# EAGLE schematic BMS_Rev1 (EAGLE 7.0.0)
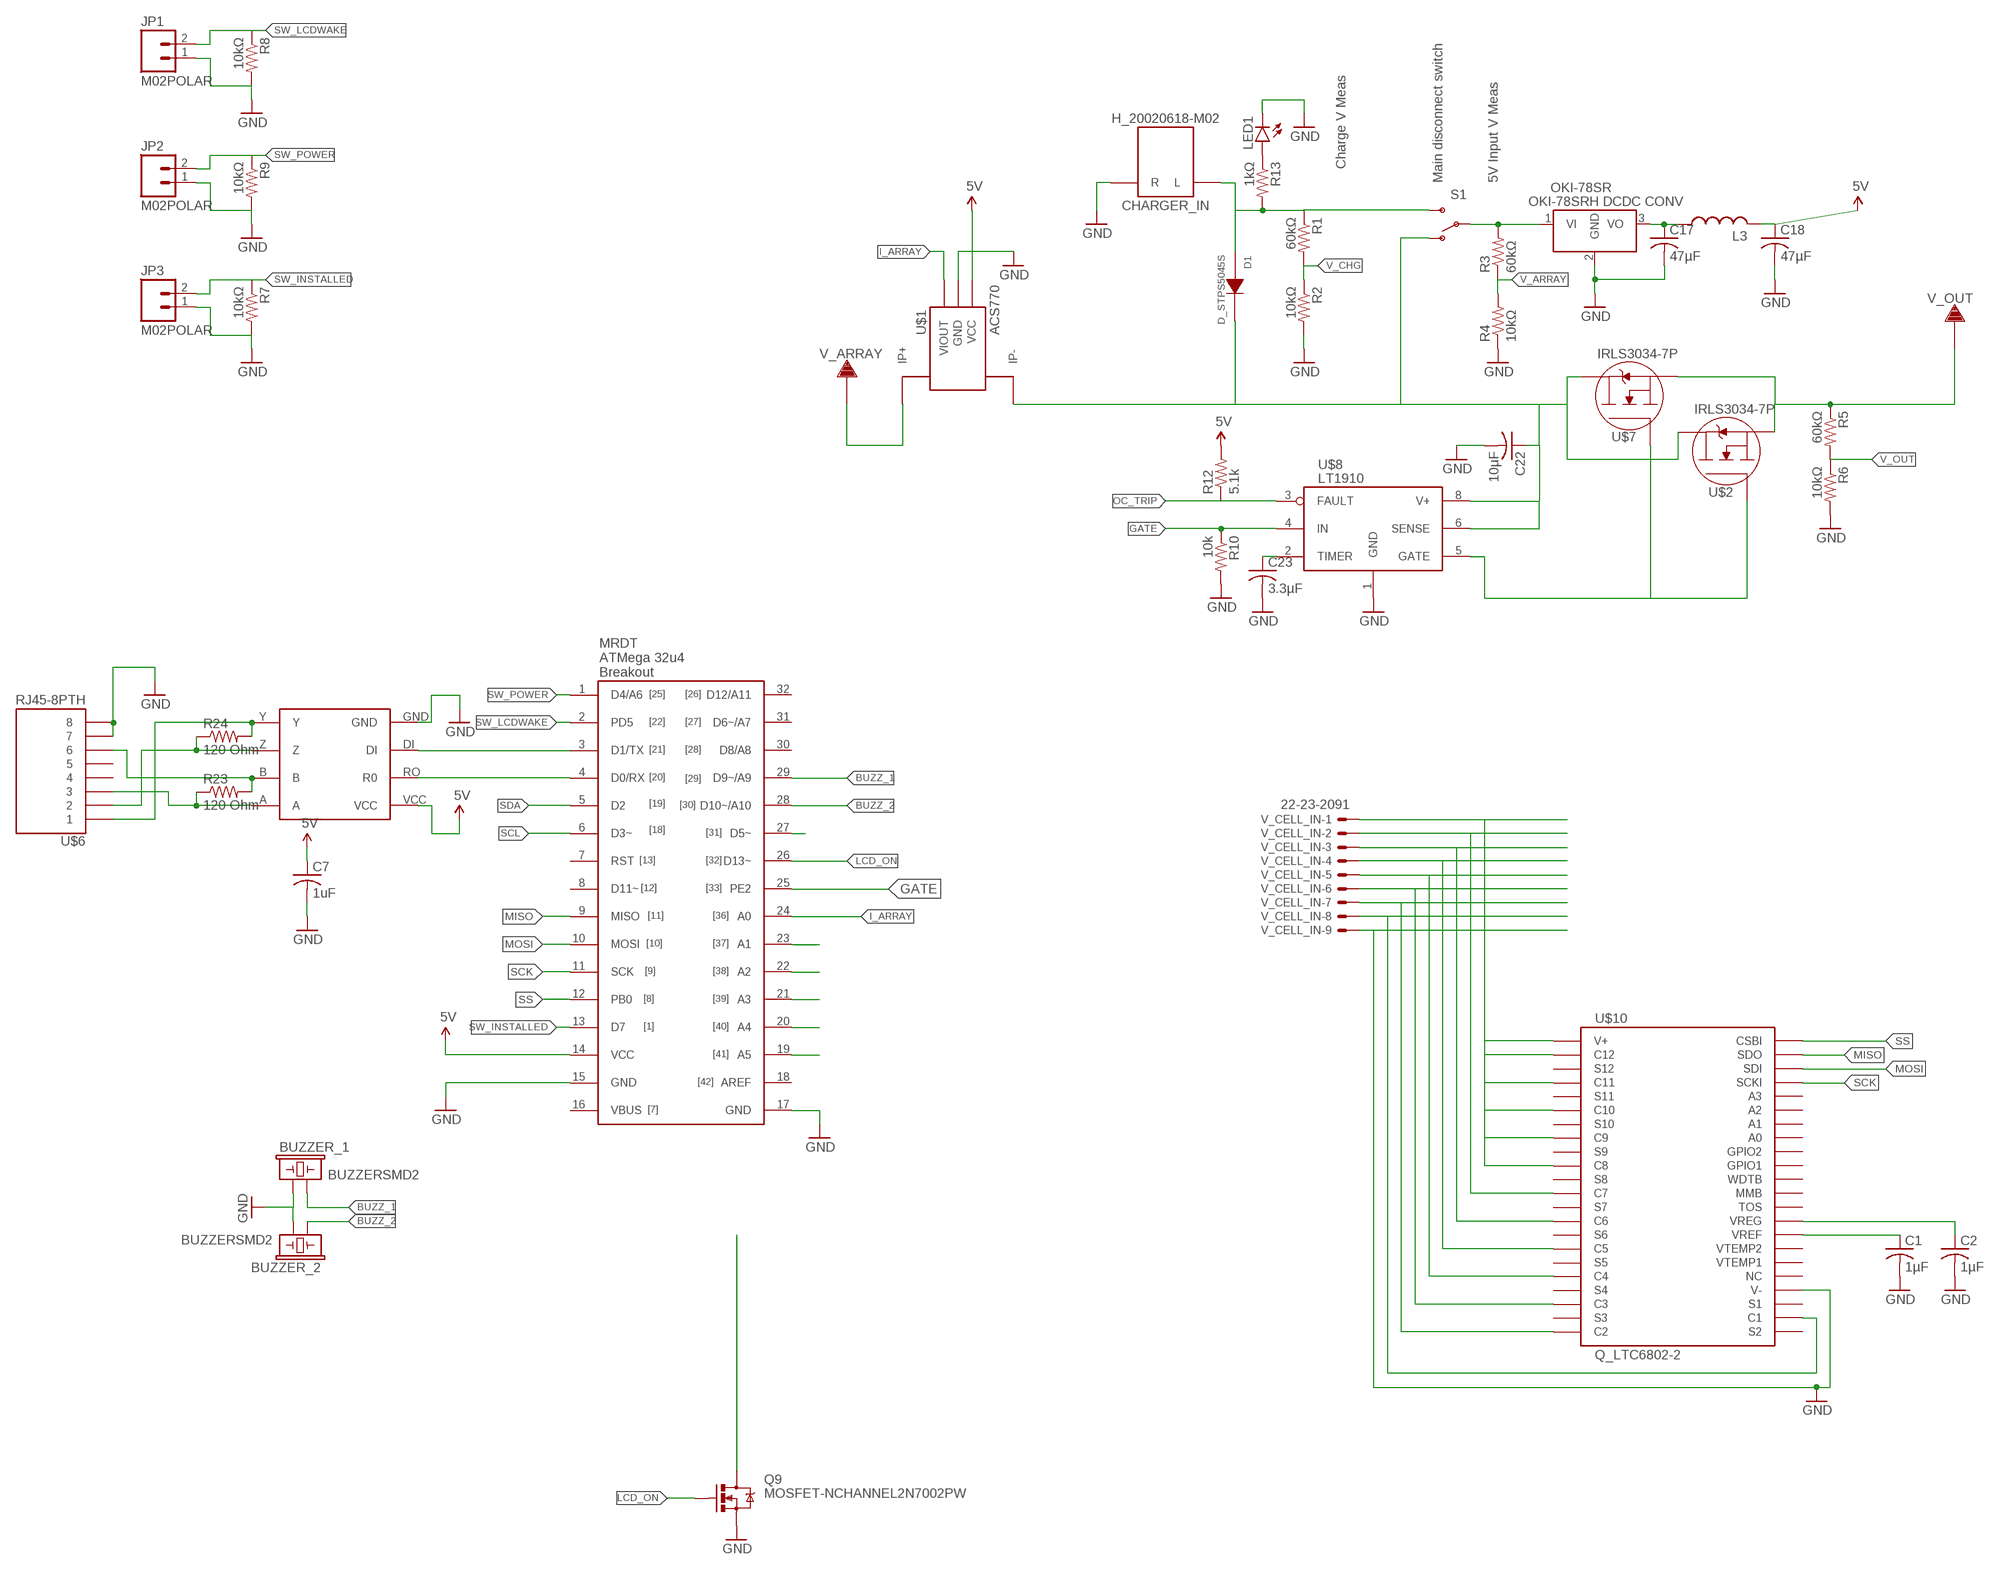
[diagram p0: schematic, sheet 1]

## Parts
BUZZER_1  BUZZERSMD2  [BUZZER-CCV]
BUZZER_2  BUZZERSMD2  [BUZZER-CCV]
C1  1µF  C-USC1206  [C1206]
C2  1µF  C-USC1206  [C1206]
C7  1uF  C-USC1206  [C1206]
C17  47µF  C-USC1206  [C1206]
C18  47µF  C-USC1206  [C1206]
C22  10µF  C-USC1206  [C1206]
C23  3.3µF  C-USC1206  [C1206]
CHARGER_IN  H_20020618-M02  [20020618-M02]
D1  D_STPS5045S  [D2PACK]
JP1  M02POLAR  [MOLEX-1X2]
JP2  M02POLAR  [MOLEX-1X2]
JP3  M02POLAR  [MOLEX-1X2]
L3  L-USL3216C  [L3216C]
LED1  LED1206  [LED-1206]
OKI-78SR  Q_OKI-78SR  [OKI-78SRH]
Q9  MOSFET-NCHANNEL2N7002PW  [SOT323]
R1  60kΩ  R-US_R1206  [R1206]
R2  10kΩ  R-US_R1206  [R1206]
R3  60kΩ  R-US_R1206  [R1206]
R4  10kΩ  R-US_R1206  [R1206]
R5  60kΩ  R-US_R1206  [R1206]
R6  10kΩ  R-US_R1206  [R1206]
R7  10kΩ  R-US_R1206  [R1206]
R8  10kΩ  R-US_R1206  [R1206]
R9  10kΩ  R-US_R1206  [R1206]
R10  10k  R-US_R1206  [R1206]
R12  5.1k  R-US_R1206  [R1206]
R13  1kΩ  R-US_R1206  [R1206]
R23  120 Ohm  RESISTOR1206  [1206]
R24  120 Ohm  RESISTOR1206  [1206]
S1  SWITCH-SPDTPTH  [SWITCH-SPDT]
U$1  ACS770  [PFF_LEADFORM]
U$2  IRLS3034-7P  [D2PAK-7]
U$3  32U4_BREAKOUT  [32U4_MCU_DIP]
U$6  RJ45-8PTH  [RJ45-8]
U$7  IRLS3034-7P  [D2PAK-7]
U$8  LT1910  [SO8]
U$9  MAX3077  [MAX3070E]
U$10  Q_LTC6802-2  [SSOP44]
V_ARRAY  TERMINAL_HOLE  [LARGE_TERMINAL_HOLE]
V_CELL_IN  22-23-2091  [22-23-2091]
V_OUT  TERMINAL_HOLE  [LARGE_TERMINAL_HOLE]

## Nets
5V: C7.1 C18.1 L3.2 R12.2 U$1.1(VCC) U$3.14(VCC) U$9.VCC
BUZZ_1: BUZZER_1.- U$3.29(D9~/A9)
BUZZ_2: BUZZER_2.+ U$3.28(D10~/A10)
GATE: R10.1 U$3.25(PE2) U$8.4(IN)
GND: BUZZER_1.+ BUZZER_2.- C1.2 C2.2 C7.2 C17.2 C18.2 C22.2 C23.2 CHARGER_IN.R1(R) CHARGER_IN.R2(R) JP1.1 JP2.1 JP3.1 LED1.C OKI-78SR.2(GND) Q9.2(S) R2.2 R4.1 R6.2 R7.2 R8.2 R9.2 R10.2 U$1.2(GND) U$3.15(GND) U$3.17(GND) U$6.7 U$6.8 U$8.1(GND) U$9.GND U$10.26(V-) V_CELL_IN.9
I_ARRAY: U$1.3(VIOUT) U$3.24(A0)
LCD_DB4: U$3.27(D5~)
LCD_ON: Q9.1(G) U$3.26(D13~)
MISO: U$3.9(MISO) U$10.43(SDO)
MOSI: U$3.10(MOSI) U$10.42(SDI)
N$1: R5.1 U$2.2(SOURCE) U$2.3(SOURCE) U$2.4(SOURCE) U$2.5(SOURCE) U$2.6(SOURCE) U$7.2(SOURCE) U$7.3(SOURCE) U$7.4(SOURCE) U$7.5(SOURCE) U$7.6(SOURCE) V_OUT.P$1
N$2: U$1.4_1(IP+) U$1.4_2(IP+) U$1.4_3(IP+) U$1.4_4(IP+) U$1.4_5(IP+) U$1.4_6(IP+) U$1.4_7(IP+) U$1.4_8(IP+) U$1.4_9(IP+) U$1.4_10(IP+) U$1.4_11(IP+) U$1.4_12(IP+) U$1.4_13(IP+) U$1.4_14(IP+) U$1.4_15(IP+) U$1.4_16(IP+) U$1.4_B(IP+) U$1.4_T(IP+) V_ARRAY.P$1
N$3: C22.1 D1.TAB(K) S1.1(O) U$1.5_1(IP-) U$1.5_2(IP-) U$1.5_3(IP-) U$1.5_4(IP-) U$1.5_5(IP-) U$1.5_6(IP-) U$1.5_7(IP-) U$1.5_8(IP-) U$1.5_9(IP-) U$1.5_10(IP-) U$1.5_11(IP-) U$1.5_12(IP-) U$1.5_13(IP-) U$1.5_14(IP-) U$1.5_15(IP-) U$1.5_16(IP-) U$1.5_B(IP-) U$1.5_T(IP-) U$2.PAD(DRAIN) U$7.PAD(DRAIN) U$8.6(SENSE) U$8.8(V+)
N$4: OKI-78SR.1(VI) R3.2 S1.2(P)
N$5: U$2.1(GATE) U$7.1(GATE) U$8.5(GATE)
N$6: R24.2 U$6.1 U$9.Y
N$7: R24.1 U$6.2 U$9.Z
N$8: CHARGER_IN.L1(L) CHARGER_IN.L2(L) D1.1(A) D1.2(A) R1.1 R13.2 S1.3(S)
N$9: R23.2 U$6.6 U$9.B
N$10: R23.1 U$6.3 U$9.A
N$11: U$3.3(D1/TX) U$9.DI
N$12: C1.1 U$10.30(VREF)
N$13: C2.1 U$10.31(VREG)
N$31: C23.1 U$8.2(TIMER)
N$32: Q9.3(D)
N$34: LED1.A R13.1
N$35: U$3.23(A1)
N$36: U$3.22(A2)
N$37: U$3.21(A3)
N$41: U$10.1(V+) U$10.2(C12) U$10.4(C11) U$10.6(C10) U$10.8(C9) U$10.10(C8) V_CELL_IN.1
N$42: U$10.12(C7) V_CELL_IN.2
N$43: U$10.14(C6) V_CELL_IN.3
N$46: U$10.20(C3) V_CELL_IN.6
N$47: U$10.22(C2) V_CELL_IN.7
N$48: U$10.24(C1) V_CELL_IN.8
N$63: U$3.19(A5)
N$64: U$3.20(A4)
N$89: U$10.16(C5) V_CELL_IN.4
N$91: U$10.18(C4) V_CELL_IN.5
N$100: C17.1 L3.1 OKI-78SR.3(VO)
OC_TRIP: R12.1 U$8.3(FAULT)
RXD: U$3.4(D0/RX) U$9.RO(R0)
SCK: U$3.11(SCK) U$10.41(SCKI)
SCL: U$3.6(D3~)
SDA: U$3.5(D2)
SS: U$3.12(PB0) U$10.44(CSBI)
SW_INSTALLED: JP3.2 R7.1 U$3.13(D7)
SW_LCDWAKE: JP1.2 R8.1 U$3.2(PD5)
SW_POWER: JP2.2 R9.1 U$3.1(D4/A6)
V_ARRAY: R3.1 R4.2
V_CHG: R1.2 R2.1
V_OUT: R5.2 R6.1
Unconnected: U$3.7(RST) U$3.8(D11~) U$3.16(VBUS) U$3.18(AREF) U$3.30(D8/A8) U$3.31(D6~/A7) U$3.32(D12/A11) U$6.4 U$6.5 U$10.3(S12) U$10.5(S11) U$10.7(S10) U$10.9(S9) U$10.11(S8) U$10.13(S7) U$10.15(S6) U$10.17(S5) U$10.19(S4) U$10.21(S3) U$10.23(S2) U$10.25(S1) U$10.27(NC) U$10.28(VTEMP1) U$10.29(VTEMP2) U$10.32(TOS) U$10.33(MMB) U$10.34(WDTB) U$10.35(GPIO1) U$10.36(GPIO2) U$10.37(A0) U$10.38(A1) U$10.39(A2) U$10.40(A3)

## Notes on the sheet
- Charge V Meas
- Main disconnect switch | 5V Input V Meas

## Library data of the parts
BUZZER_1 BUZZER_2 = SparkFun-Electromechanical:BUZZER: Buzzer 12mm Spark Fun Electronics SKU : Comp-Buzzer
C1 C2 C7 C17 C18 C22 C23 = resistor:C-US: CAPACITOR, American symbol
CHARGER_IN = MRDT-2015-PowerBoard:H_20020618-M02*: 20020618-M02* header pin from FCI. Rated up to 32A
D1 = MRDT-2015-BMS:D_STPS5045S
JP1-JP3 = SparkFun-Connectors:M02: Standard 2-pin 0.1" header. Use with - straight break away headers ( PRT-00116) - right angle break away headers (PRT-00553) - swiss pins (PRT-00743) - machine pins (PRT-00117) - female headers (PRT-00115) Molex polarized connector foot print use with: PRT-08233 with associated crimp pins and housings. 2.54_SCREWTERM for use with PRT-10571. 3.5mm Screw Terminal footprints for PRT-08084 5mm Screw Terminal footprints for use with PRT-08433
L3 = resistor:L-US: INDUCTOR, American symbol
LED1 = SparkFun-LED:LED: LEDs Standard schematic elements and footprints for 5mm, 3mm, 1206, and 0603 sized LEDs. 5mm - Spark Fun Electronics SKU : COM-00529 (and others)
OKI-78SR = MRDT-2015-PowerBoard:Q_OKI-78SR: 4.95W DC/DC Converter Manufacturer: Murata Part Number: OKI-78SR-5/1.5-W36H-C OKI-78SR-3.3/1.5-W36H-C
Q9 = SparkFun-DiscreteSemi:MOSFET-NCHANNEL: Common NMOSFET Parts MFG P/N Store ID Prod ID FDD8780 TRANS-09984 SI7820DN TRANS-11055 FDS6630A IC-08089 2N7002PW TRANS-11151 FQP30N06L COM-10213 TRANS-10060 BSS123LT1G TRANS-08345 BSS138 TRANS-00830 BS170 2N7000; PROD_ID: TRANS-11151
R1-R10 R12 R13 = resistor:R-US_: RESISTOR, American symbol
R23 R24 = SparkFun-Passives:RESISTOR: Resistor Basic schematic elements and footprints for 0603, 1206, and PTH resistors.
S1 = SparkFun-Electromechanical:SWITCH-SPDT: SPDT Switch Simple slide switch, Spark Fun Electronics SKU : COM-00102 DPDT SMT slide switch, AYZ0202, SWCH-08179
U$1 = MRDT-2015-BMS:ACS770
U$2 U$7 = MRDT-2015-BMS:IRLS3034-7P: High-current SMD MOSFET
U$3 = MRDT-2015-General:32U4_BREAKOUT
U$6 = SparkFun-Connectors:RJ45-8: RJ45 Jack Simple RJ45, 8-pin connection - connector for common Cat5, Cat5e, and Cat6 Ethernet cables. Footprint not yet proven in production. Connector sku is PRT-00643; Breakout PCB sku is BOB-00716.
U$8 = MRDT-2015-PowerBoard:LT1910
U$9 = MAX3077:MAX3077
U$10 = MRDT-2015-BMS:Q_LTC6802-2
V_ARRAY V_OUT = MRDT-2015-PowerBoard:TERMINAL_HOLE
V_CELL_IN = con-molex:22-23-2091: .100" (2.54mm) Center Header - 9 Pin; MF: MOLEX; MPN: 22-23-2091; OC_FARNELL: 1756827; OC_NEWARK: 56H0450